# EasyEDA schematic elrs TX E28.json
TITLE: Sheet_1; REV: 1.0; Date: 2022-07-24; Sheet: 1/1; Company: Your Company
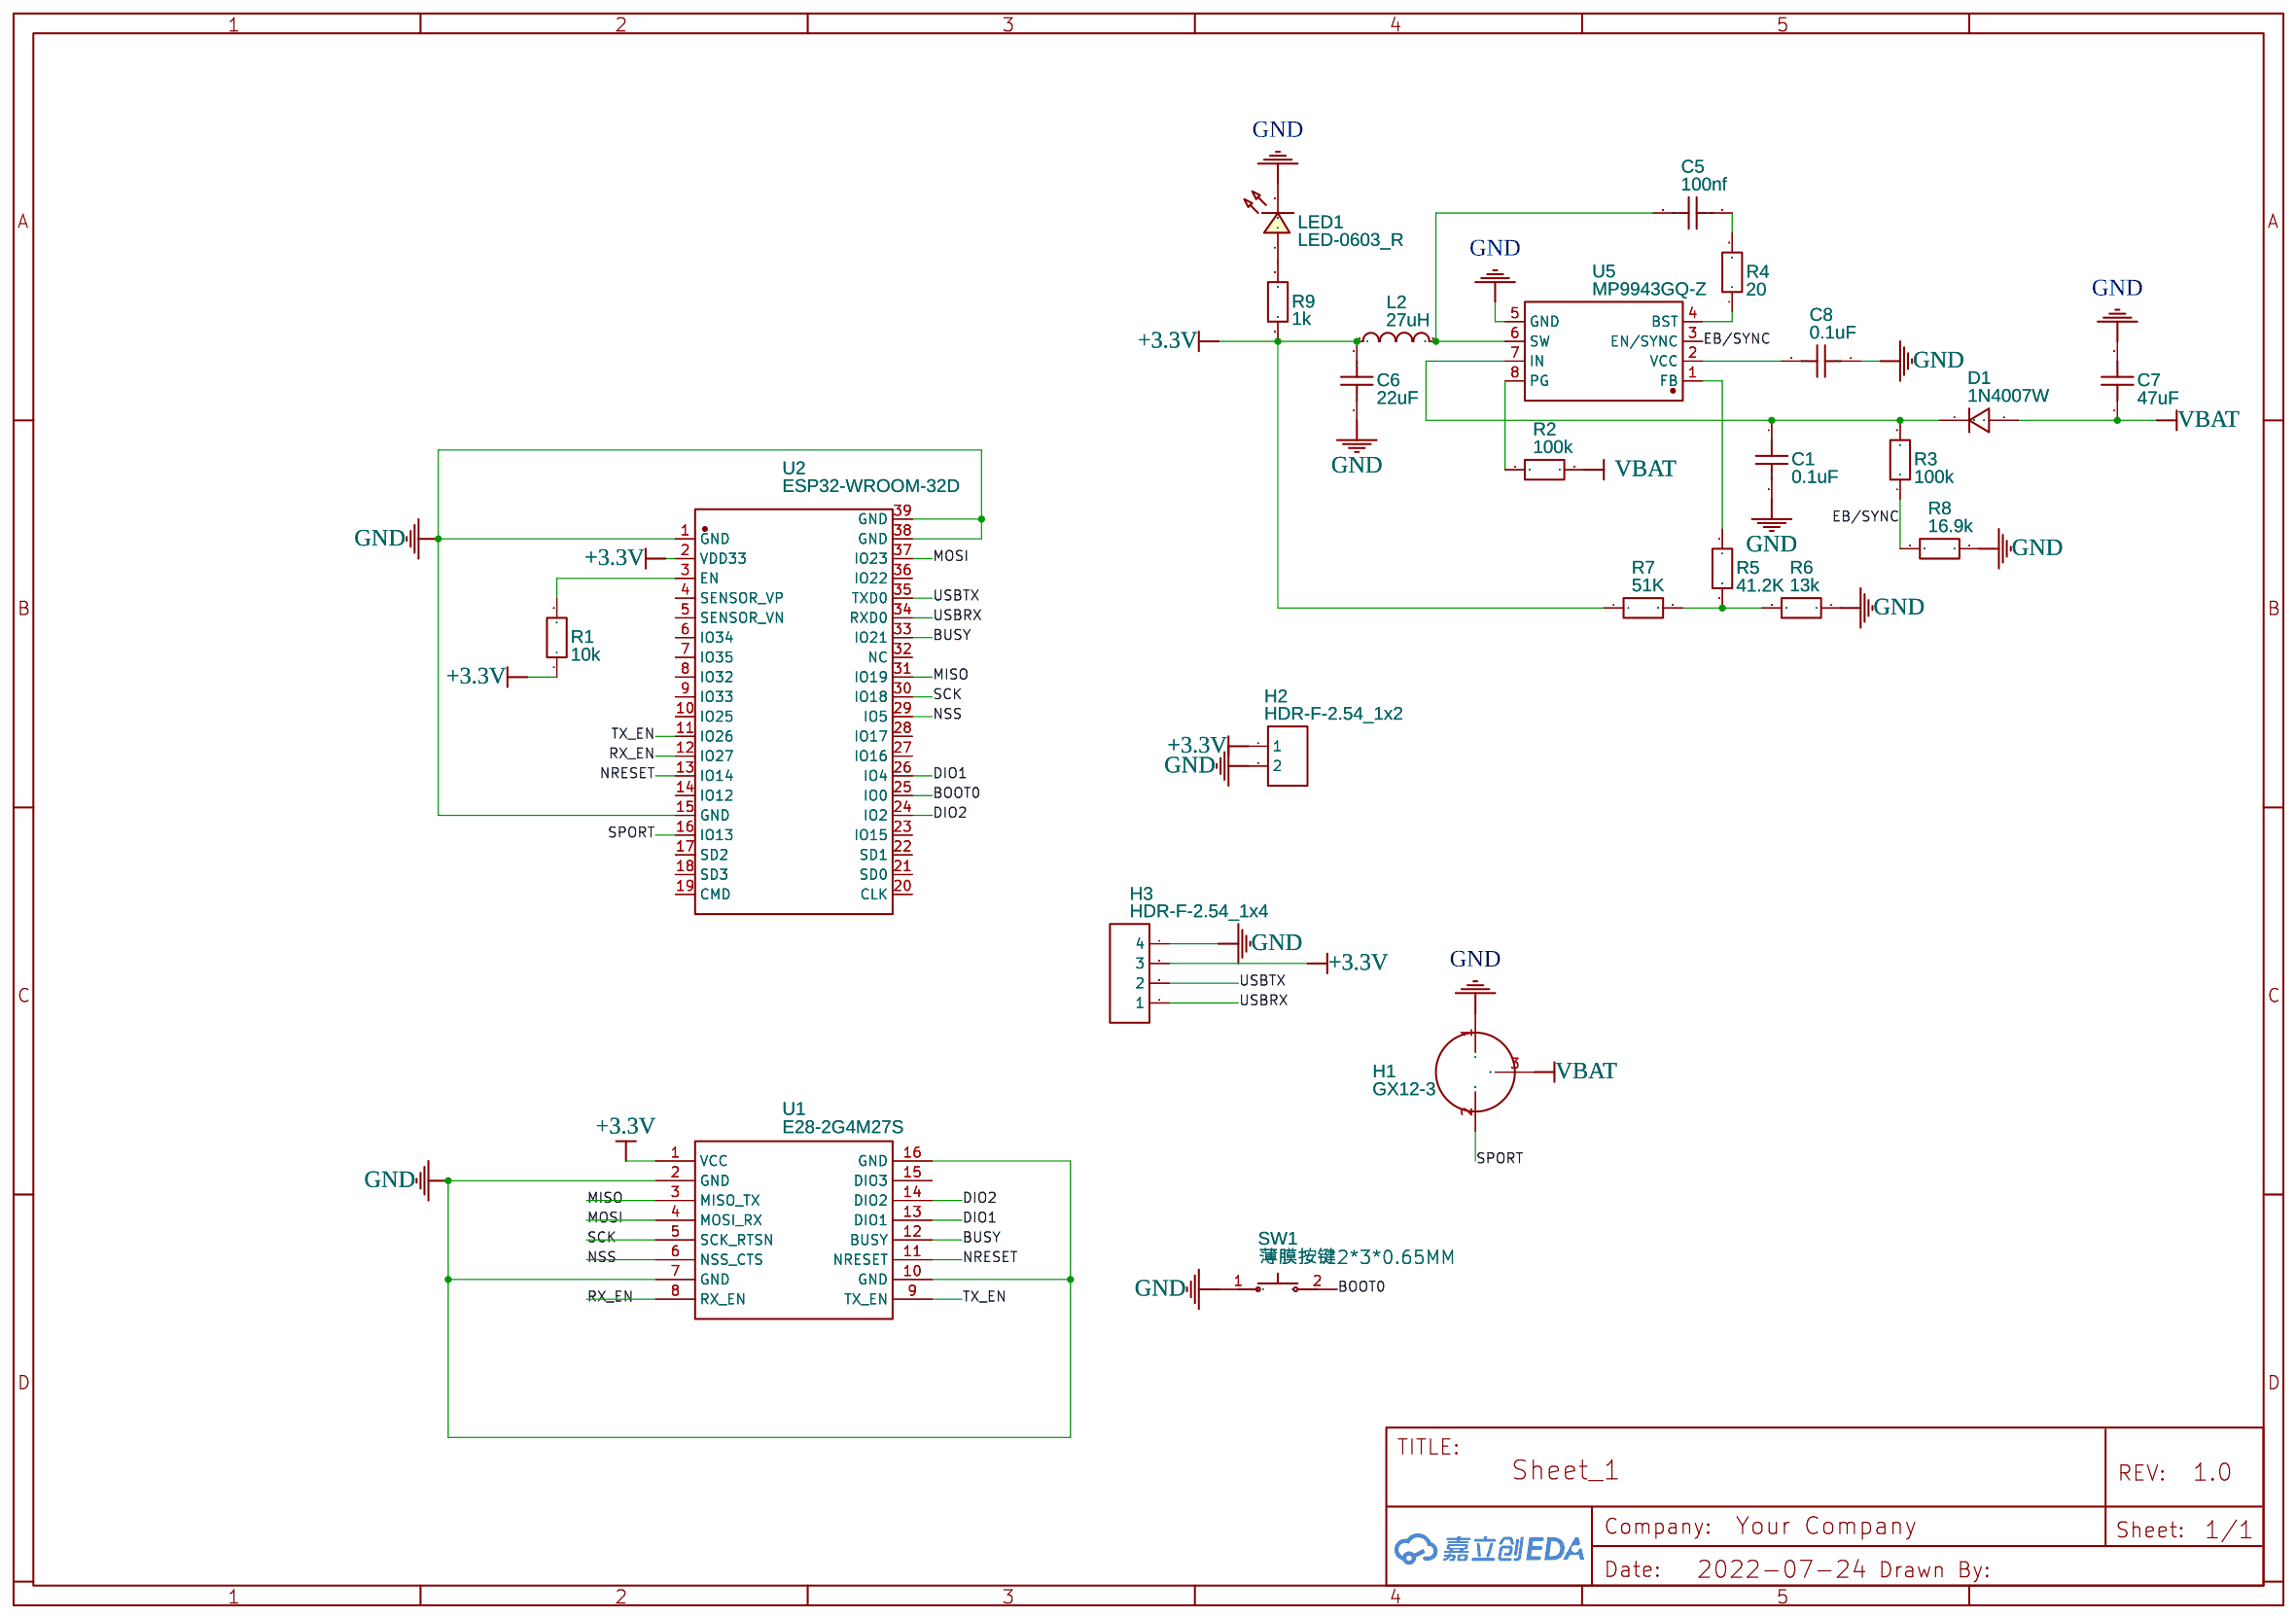
[diagram p0: schematic sheet]

## Parts
C1  0.1uF  [C0603]
C5  100nf  [C0603]
C6  22uF  [C0603]
C7  47uF  [C0603]
C8  0.1uF  [C0603]
D1  1N4007W  [SOD-123_L2.8-W1.8-LS3.7-RD]
H1  GX12-3  [GX12-3]
H2  HDR-F-2.54_1x2  [HDR-F-2.54_1X2]
H3  HDR-F-2.54_1x4  [HDR-F-2.54_1X4]
L2  27uH  [L0603]
LED1  LED-0603_R  [LED0603_RED]
R1  10k  [R0603]
R2  100k  [R0603]
R3  100k  [R0603]
R4  20  [R0603]
R5  41.2K  [R0603]
R6  13k  [R0603]
R7  51K  [R0603]
R8  16.9k  [R0603]
R9  1k  [R0603]
SW1  薄膜按键2*3*0.65MM  [KEY-SMD_L3.0-W2.0-LS3.5]
U1  E28-2G4M27S  [WIRELM-SMD_E28-2G4M2XS]
U2  ESP32-WROOM-32D  [WIFIM-SMD_39P-L25.5-W18.0-P1.27-BL]
U5  MP9943GQ-Z  [QFN-8_L3.0-W3.0-P0.65-BL]

## Library data of the parts
C1 C5-C8 = C_0603_US: Contributor: LCEDA_Lib
D1 = 1N4007W: Supplier: LCSC; Supplier Part: C328592; Manufacturer: BLUE ROCKET; Contributor: LCEDA_Lib
H1 = GX12-3: Contributor: Crazy0qwer
H2 = HDR-F-2.54_1x2: Supplier Part: C49661; Supplier: LCSC; Contributor: LCEDA_Lib
H3 = HDR-F-2.54_1x4: Supplier Part: C225501; Supplier: LCSC; Contributor: LCEDA_Lib
L2 = L0603_US: Contributor: LCEDA_Lib
LED1 = LED-0603_R: Manufacturer: EVERLIGHT(台湾亿光); Manufacturer Part: 19-217/R6C-AL1M2VY/3T; Supplier Part: C72044; Supplier: LCSC; Contributor: LCEDA_01
R1-R9 = R_0603_EU: Contributor: LCEDA_Lib
SW1 = 薄膜按键2*3*0.65MM: Supplier: LCSC; Supplier Part: C9900015708; Manufacturer: null; JLCPCB Part Class: Extended Part; Contributor: lcsc
U1 = E28-2G4M27S: Supplier: LCSC; Supplier Part: C411312; Manufacturer: Chengdu Ebyte Elec Tech; Contributor: LCSC; JLCPCB Part Class: Extended Part
U2 = ESP32-WROOM-32D: Supplier: LCSC; Supplier Part: C473012; Manufacturer: ESPRESSIF 乐鑫; Contributor: LCSC; JLCPCB Part Class: Extended Part
U5 = MP9943GQ-Z: Supplier: LCSC; Supplier Part: C477821; Manufacturer: null; Contributor: LCSC; JLCPCB Part Class: Extended Part

## Nets
+3.3V: C6.2 H2.1 H3.3 L2.1 R1.1 R7.1 R9.1 U1.1(VCC) U2.2(VDD33)
GND: C1.2 C6.1 C7.2 C8.1 H1.1 H2.2 H3.4 LED1.2 R6.1 R8.1 SW1.1 U1.2(GND) U1.7(GND) U1.10(GND) U1.16(GND) U2.1(GND) U2.15(GND) U2.38(GND) U2.39(GND) U5.5(GND)
VBAT: C7.1 D1.2 H1.3 R2.2
BOOT0: SW1.2 U2.25(IO0)
BUSY: U1.12(BUSY) U2.33(IO21)
DIO1: U1.13(DIO1) U2.26(IO4)
DIO2: U1.14(DIO2) U2.24(IO2)
EB/SYNC: R3.1 R8.2 U5.3(EN/SYNC)
MISO: U1.3(MISO_TX) U2.31(IO19)
MOSI: U1.4(MOSI_RX) U2.37(IO23)
NRESET: U1.11(NRESET) U2.13(IO14)
NSS: U1.6(NSS_CTS) U2.29(IO5)
RX_EN: U1.8(RX_EN) U2.12(IO27)
SCK: U1.5(SCK_RTSN) U2.30(IO18)
SPORT: H1.2 U2.16(IO13)
TX_EN: U1.9(TX_EN) U2.11(IO26)
USBRX: H3.1 U2.34(RXD0)
USBTX: H3.2 U2.35(TXD0)
Net-(C1-1): C1.1 D1.1 R3.2 U5.7(IN)
Net-(C5-1): C5.1 R4.2
Net-(C5-2): C5.2 L2.2 U5.6(SW)
Net-(C8-2): C8.2 U5.2(VCC)
Net-(LED1-1): LED1.1 R9.2
Net-(R1-2): R1.2 U2.3(EN)
Net-(R2-1): R2.1 U5.8(PG)
Net-(R4-1): R4.1 U5.4(BST)
Net-(R5-1): R5.1 U5.1(FB)
Net-(R5-2): R5.2 R6.2 R7.2

Not connected (* = marked no-connect by the designer): U1 15(DIO3); U2 4(SENSOR_VP) 5(SENSOR_VN) 6(IO34) 7(IO35) 8(IO32) 9(IO33) 10(IO25) 14(IO12) 17(SD2) 18(SD3) 19(CMD) 20(CLK) 21(SD0) 22(SD1) 23(IO15) 27(IO16) 28(IO17) 32(NC) 36(IO22)
